# EAGLE design ssop28Adapter (EAGLE 9.6.2)
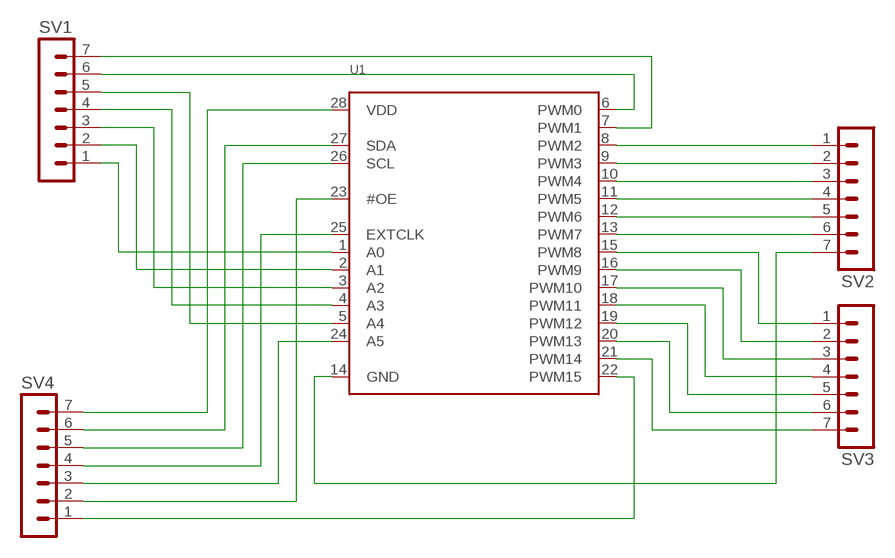
[diagram p0: schematic, sheet 1]

## Parts
SV1  MA07-1  [MA07-1]
SV2  MA07-1  [MA07-1]
SV3  MA07-1  [MA07-1]
SV4  MA07-1  [MA07-1]
U1  PCA9685  [TSSOP28]

## Nets
N$1: SV1.1 U1.1(A0)
N$2: SV1.2 U1.2(A1)
N$3: SV1.3 U1.3(A2)
N$4: SV1.4 U1.4(A3)
N$5: SV1.5 U1.5(A4)
N$6: SV1.6 U1.6(PWM0)
N$7: SV1.7 U1.7(PWM1)
N$8: SV2.1 U1.8(PWM2)
N$9: SV2.2 U1.9(PWM3)
N$10: SV2.3 U1.10(PWM4)
N$11: SV2.4 U1.11(PWM5)
N$12: SV2.5 U1.12(PWM6)
N$13: SV2.6 U1.13(PWM7)
N$14: SV2.7 U1.14(GND)
N$15: SV3.1 U1.15(PWM8)
N$16: SV3.2 U1.16(PWM9)
N$17: SV3.3 U1.17(PWM10)
N$18: SV3.4 U1.18(PWM11)
N$19: SV3.5 U1.19(PWM12)
N$20: SV3.6 U1.20(PWM13)
N$21: SV3.7 U1.21(PWM14)
N$22: SV4.1 U1.22(PWM15)
N$23: SV4.2 U1.23(#OE)
N$24: SV4.3 U1.24(A5)
N$25: SV4.4 U1.25(EXTCLK)
N$26: SV4.5 U1.26(SCL)
N$27: SV4.6 U1.27(SDA)
N$28: SV4.7 U1.28(VDD)

## Library data of the parts
SV1-SV4 = con-lstb:MA07-1: PIN HEADER; OC_FARNELL: unknown; OC_NEWARK: unknown
U1 = bidpl:PCA9685: PCA9685 - 16 Channel 12-Bit I2C PWM Controller 5.0V tolerant 16 channel, 12-bit I2C PWM controller with 25mA per output (max. 400mA total) Digikey: 568-5931-1-ND

## Board
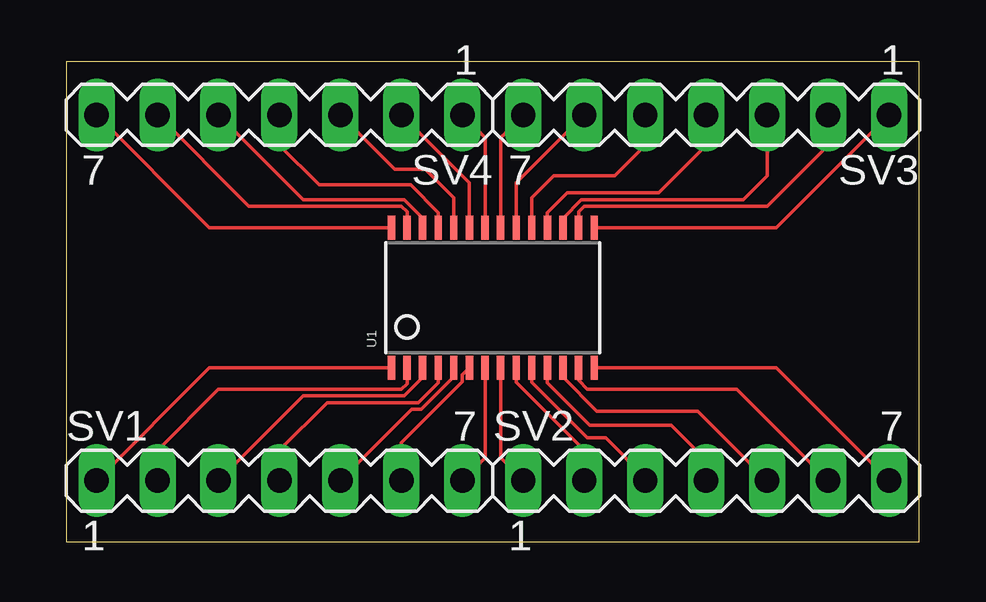
[diagram p1: board, top side]

Size 35.54 x 19.99 mm. Coordinates in mm from the lower left corner, seen from the top.
Outline: 0,0 35.54,0 35.54,19.99 0,19.99 0,0
Copper layers (1*16): Top 0.035559375mm / dielectric 1.6mm / Bottom 0.035559375mm
Design rules "jlcpcb2layer": minimum track width 5mil, minimum drill 12mil, track to track 5mil, track to pad 5mil, pad to pad 5mil, via to via 5mil, smd to smd 5mil, copper to edge 8mil, drill to drill 6mil, minimum pad ring 5mil, minimum via ring 3mil, stop-mask expansion 2.5mil, vias tented up to drill 0mil, thermal gap 10mil

### Footprints (pad centres in the part's own frame; a part is rotated, then mirrored left to right if it is on the bottom)
MA07-1 = drill 1.016 long: 1 -7.62,0; 2 -5.08,0; 3 -2.54,0; 4 0,0; 5 2.54,0; 6 5.08,0; 7 7.62,0
TSSOP28 = smd 0.305 x 0.991: 1 -4.225,-2.918; 2 -3.575,-2.918; 3 -2.925,-2.918; 4 -2.275,-2.918; 5 -1.625,-2.918; 6 -0.975,-2.918; 7 -0.325,-2.918; 8 0.325,-2.918; 9 0.975,-2.918; 10 1.625,-2.918; 11 2.275,-2.918; 12 2.925,-2.918; 13 3.575,-2.918; 14 4.225,-2.918; 15 4.225,2.918; 16 3.575,2.918; 17 2.925,2.918; 18 2.275,2.918; 19 1.625,2.918; 20 0.975,2.918; 21 0.325,2.918; 22 -0.325,2.918; 23 -0.975,2.918; 24 -1.625,2.918; 25 -2.275,2.918; 26 -2.925,2.918; 27 -3.575,2.918; 28 -4.225,2.918

### Placement (x,y rotation side)
SV1  8.89,2.54 0 top
SV2  26.67,2.54 0 top
SV3  26.67,17.78 180 top
SV4  8.89,17.78 180 top
U1  17.78,10.16 0 top

### Tracks (layer width: path | path; a pad name or v marks a point on that pad's centre or on a via)
N$1
  Top 0.152: SV1.1 5.97,7.24 U1.1
N$2
  Top 0.152: U1.2 14.21,6.58 13.97,6.35 6.35,6.35 3.81,3.81 SV1.2
N$3
  Top 0.152: SV1.3 9.88,6.07 14.09,6.07 14.86,6.84 U1.3
N$4
  Top 0.152: SV1.4 8.89,3.81 10.87,5.79 14.68,5.79 15.51,6.62 U1.4
N$5
  Top 0.152: U1.5 16.16,6.87 14.8,5.51 14.4,5.51 SV1.5
N$6
  Top 0.152: U1.6 16.51,6.95 16.51,6.66 13.97,4.12 SV1.6
N$7
  Top 0.152: SV1.7 17.45,3.48 U1.7
N$8
  Top 0.152: U1.8 18.11,3.48 SV2.1
N$9
  Top 0.152: U1.9 18.75,6.64 21.59,3.81 SV2.2
N$10
  Top 0.152: U1.10 19.41,6.63 21.72,4.32 22.48,4.32 24.13,2.67 SV2.3
N$11
  Top 0.152: U1.11 20.05,6.62 21.82,4.85 25.22,4.85 26.67,3.4 SV2.4
N$12
  Top 0.152: SV2.5 26.31,5.44 22.11,5.44 20.7,6.84 U1.12
N$13
  Top 0.152: U1.13 21.36,6.71 21.72,6.35 27.94,6.35 SV2.6
N$14
  Top 0.152: U1.14 29.59,7.24 SV2.7
N$15
  Top 0.152: U1.15 29.59,13.08 SV3.1
N$16
  Top 0.152: U1.16 21.36,13.73 21.59,13.97 29.21,13.97 31.75,16.51 SV3.2
N$17
  Top 0.152: U1.17 20.7,13.48 21.47,14.25 28.22,14.25 29.21,15.24 SV3.3
N$18
  Top 0.152: U1.18 20.05,13.71 20.88,14.53 24.69,14.53 26.67,16.51 SV3.4
N$19
  Top 0.152: U1.19 19.41,14.32 20.32,15.24 22.86,15.24 24.13,16.51 SV3.5
N$20
  Top 0.152: U1.20 18.75,14.95 SV3.6
N$21
  Top 0.152: U1.21 18.11,16.84 SV3.7
N$22
  Top 0.152: U1.22 17.45,16.84 SV4.1
N$23
  Top 0.152: U1.23 16.8,14.95 SV4.2
N$24
  Top 0.152: U1.24 16.16,14.32 14.96,15.52 13.69,15.52 SV4.3
N$25
  Top 0.152: U1.25 15.51,13.71 14.35,14.86 10.54,14.86 8.89,16.51 SV4.4
N$26
  Top 0.152: SV4.5 9.88,14.25 14.09,14.25 14.86,13.48 U1.26
N$27
  Top 0.152: U1.27 14.21,13.73 13.97,13.97 7.62,13.97 SV4.6
N$28
  Top 0.152: U1.28 5.97,13.08 SV4.7